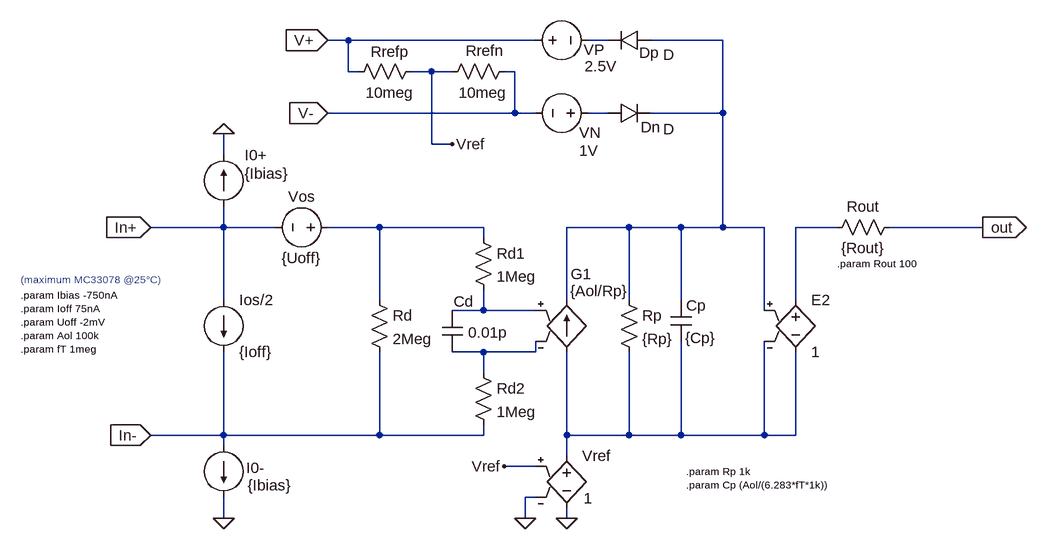
[diagram p0: schematic oppwr_mod.asc]
oppwr_mod.asc, the LTspice schematic file:
Version 4
SHEET 1 1376 680
WIRE 304 -240 272 -240
WIRE 592 -240 304 -240
WIRE 704 -240 672 -240
WIRE 880 -240 768 -240
WIRE 304 -192 304 -240
WIRE 320 -192 304 -192
WIRE 432 -192 400 -192
WIRE 464 -192 432 -192
WIRE 560 -192 544 -192
WIRE 304 -128 272 -128
WIRE 560 -128 560 -192
WIRE 560 -128 304 -128
WIRE 592 -128 560 -128
WIRE 704 -128 672 -128
WIRE 880 -128 880 -240
WIRE 880 -128 768 -128
WIRE 432 -80 432 -192
WIRE 464 -80 432 -80
WIRE 112 -64 112 -96
WIRE 48 48 0 48
WIRE 112 48 112 16
WIRE 112 48 48 48
WIRE 192 48 112 48
WIRE 352 48 272 48
WIRE 432 48 352 48
WIRE 512 48 432 48
WIRE 656 48 640 48
WIRE 736 48 656 48
WIRE 816 48 736 48
WIRE 880 48 880 -128
WIRE 880 48 816 48
WIRE 944 48 880 48
WIRE 1056 48 992 48
WIRE 1200 48 1136 48
WIRE 1280 48 1200 48
WIRE 512 64 512 48
WIRE 112 160 112 48
WIRE 352 160 352 48
WIRE 640 160 640 48
WIRE 736 160 736 48
WIRE 816 160 816 48
WIRE 992 160 992 48
WIRE 512 176 512 144
WIRE 512 176 464 176
WIRE 592 176 512 176
WIRE 944 176 944 48
WIRE 512 240 464 240
WIRE 592 240 592 224
WIRE 592 240 512 240
WIRE 512 272 512 240
WIRE 352 304 352 240
WIRE 48 368 0 368
WIRE 112 368 112 240
WIRE 112 368 48 368
WIRE 352 368 352 304
WIRE 352 368 112 368
WIRE 432 368 352 368
WIRE 512 368 512 352
WIRE 512 368 432 368
WIRE 640 368 640 240
WIRE 736 368 736 240
WIRE 736 368 640 368
WIRE 816 368 816 224
WIRE 816 368 736 368
WIRE 944 368 944 224
WIRE 944 368 816 368
WIRE 992 368 992 240
WIRE 992 368 944 368
WIRE 112 384 112 368
WIRE 640 400 640 368
WIRE 576 416 544 416
WIRE 592 416 576 416
WIRE 592 464 576 464
WIRE 112 496 112 464
WIRE 576 496 576 464
WIRE 640 496 640 480
FLAG 640 496 0
FLAG 112 496 0
FLAG 112 -96 0
FLAG 0 368 In-
IOPIN 0 368 In
FLAG 0 48 In+
IOPIN 0 48 In
FLAG 1280 48 out
IOPIN 1280 48 Out
FLAG 272 -240 V+
IOPIN 272 -240 In
FLAG 272 -128 V-
IOPIN 272 -128 In
FLAG 576 496 0
FLAG 464 -80 Vref
FLAG 544 416 Vref
DATAFLAG 48 368 ""
DATAFLAG 48 48 ""
DATAFLAG 656 48 ""
DATAFLAG 304 -240 ""
DATAFLAG 304 -128 ""
DATAFLAG 992 48 ""
DATAFLAG 432 48 ""
DATAFLAG 352 304 "I(x1:Rd)"
DATAFLAG 432 368 ""
DATAFLAG 576 416 ""
DATAFLAG 1200 48 ""
SYMBOL current 112 160 R0
SYMATTR InstName Ios/2
SYMATTR Value {Ioff}
SYMBOL current 112 384 R0
WINDOW 0 35 34 Left 2
WINDOW 3 37 61 Left 2
WINDOW 123 0 0 Left 2
WINDOW 39 0 0 Left 2
SYMATTR InstName I0-
SYMATTR Value {Ibias}
SYMBOL current 112 16 R180
WINDOW 0 -67 79 Left 2
WINDOW 3 -100 51 Left 2
WINDOW 123 0 0 Left 2
WINDOW 39 0 0 Left 2
SYMATTR InstName I0+
SYMATTR Value {Ibias}
SYMBOL voltage 288 48 M270
WINDOW 0 32 56 VTop 2
WINDOW 3 -32 56 VBottom 2
SYMATTR InstName Vos
SYMATTR Value {Uoff}
SYMBOL res 336 144 R0
SYMATTR InstName Rd
SYMATTR Value 2Meg
SYMBOL res 496 48 R0
SYMATTR InstName Rd1
SYMATTR Value 1Meg
SYMBOL res 496 256 R0
SYMATTR InstName Rd2
SYMATTR Value 1Meg
SYMBOL res 720 144 R0
SYMATTR InstName Rp
SYMATTR Value {Rp}
SYMBOL cap 800 160 R0
WINDOW 3 22 58 Left 2
SYMATTR Value {Cp}
SYMATTR InstName Cp
SYMBOL cap 448 176 R0
WINDOW 0 18 -14 Left 2
WINDOW 3 40 34 Left 2
SYMATTR InstName Cd
SYMATTR Value 0.01p
SYMBOL e 992 144 R0
SYMATTR InstName E2
SYMATTR Value 1
SYMBOL voltage 576 -240 R270
WINDOW 0 -30 106 VTop 2
WINDOW 3 -24 116 VBottom 2
SYMATTR InstName VP
SYMATTR Value 2.5V
SYMBOL voltage 688 -128 R90
WINDOW 0 46 12 VBottom 2
WINDOW 3 42 14 VTop 2
SYMATTR InstName VN
SYMATTR Value 1V
SYMBOL diode 768 -256 R90
WINDOW 0 51 1 VBottom 2
WINDOW 3 23 -29 VTop 2
SYMATTR InstName Dp
SYMBOL diode 704 -144 M90
WINDOW 0 53 65 VBottom 2
WINDOW 3 25 93 VTop 2
SYMATTR InstName Dn
SYMBOL res 1152 32 R90
WINDOW 0 0 56 VBottom 2
WINDOW 3 32 56 VTop 2
SYMATTR InstName Rout
SYMATTR Value {Rout}
SYMBOL g 640 144 R0
WINDOW 0 6 -24 Left 2
WINDOW 3 5 2 Left 2
SYMATTR InstName G1
SYMATTR Value {Aol/Rp}
SYMBOL e 640 384 R0
WINDOW 3 26 81 Left 2
SYMATTR Value 1
SYMATTR InstName Vref
SYMBOL res 416 -208 R90
WINDOW 0 1 48 VBottom 2
WINDOW 3 33 48 VTop 2
SYMATTR InstName Rrefp
SYMATTR Value 10meg
SYMBOL res 560 -208 R90
WINDOW 0 0 46 VBottom 2
WINDOW 3 33 49 VTop 2
SYMATTR InstName Rrefn
SYMATTR Value 10meg
TEXT -200 152 Left 1 !.param Ibias -750nA\n.param Ioff 75nA\n.param Uoff -2mV\n.param Aol 100k\n.param fT 1meg
TEXT -200 128 Left 1 ;(maximum MC33078 @25°C)
TEXT 1056 104 Left 1 !.param Rout 100
TEXT 824 424 Left 1 !.param Rp 1k\n.param Cp (Aol/(6.283*fT*1k))

The netlist it stands for:
* oppwr_mod.asc
Ios/2 In+ In- {Ioff}
I0- In- 0 {Ibias}
I0+ In+ 0 {Ibias}
Vos N004 In+ {Uoff}
Rd N004 In- 2Meg
Rd1 N004 N006 1Meg
Rd2 N007 In- 1Meg
Rp N002 N008 {Rp}
Cp N002 N008 {Cp}
Cd N006 N007 0.01p
E2 N005 N008 N002 N008 1
VP V+ N001 2.5V
VN N003 V- 1V
Dp N002 N001 D
Dn N003 N002 D
Rout out N005 {Rout}
G1 N008 N002 N006 N007 {Aol/Rp}
E§Vref N008 0 Vref 0 1
Rrefp Vref V+ 10meg
Rrefn V- Vref 10meg
.model D D
.lib standard.dio
.param Ibias -750nA
.param Ioff 75nA
.param Uoff -2mV
.param Aol 100k
.param fT 1meg
* (maximum MC33078 @25°C)
.param Rout 100
.param Rp 1k
.param Cp (Aol/(6.283*fT*1k))
.backanno
.end